# Altium schematic sheet Conexion_actuadores.SchDoc
size A4
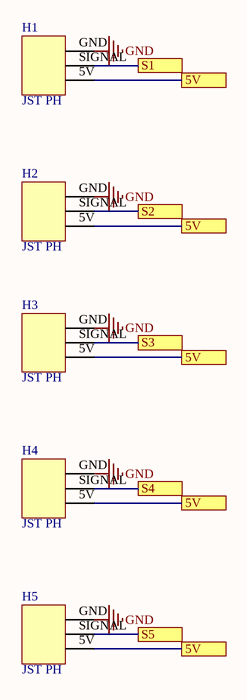
[diagram p0: Conexion_actuadores.SchDoc]

## Parts
H1  JST PH  [Conector_Servo]
H2  JST PH  [Conector_Servo]
H3  JST PH  [Conector_Servo]
H4  JST PH  [Conector_Servo]
H5  JST PH  [Conector_Servo]

## Ports
5V, S1, S2, S3, S4, S5

## Nets
GND: H1.GND H2.GND H3.GND H4.GND H5.GND
5V: H1.5V H2.5V H3.5V H4.5V H5.5V ; port 5V
S1: H1.SIGNAL ; port S1
S2: H2.SIGNAL ; port S2
S3: H3.SIGNAL ; port S3
S4: H4.SIGNAL ; port S4
S5: H5.SIGNAL ; port S5

## Library data of the parts
H1-H5 = Header_Pin_1X3_Servo